# Altium schematic sheet Attenuverter_v1_SCH.SchDoc
size A
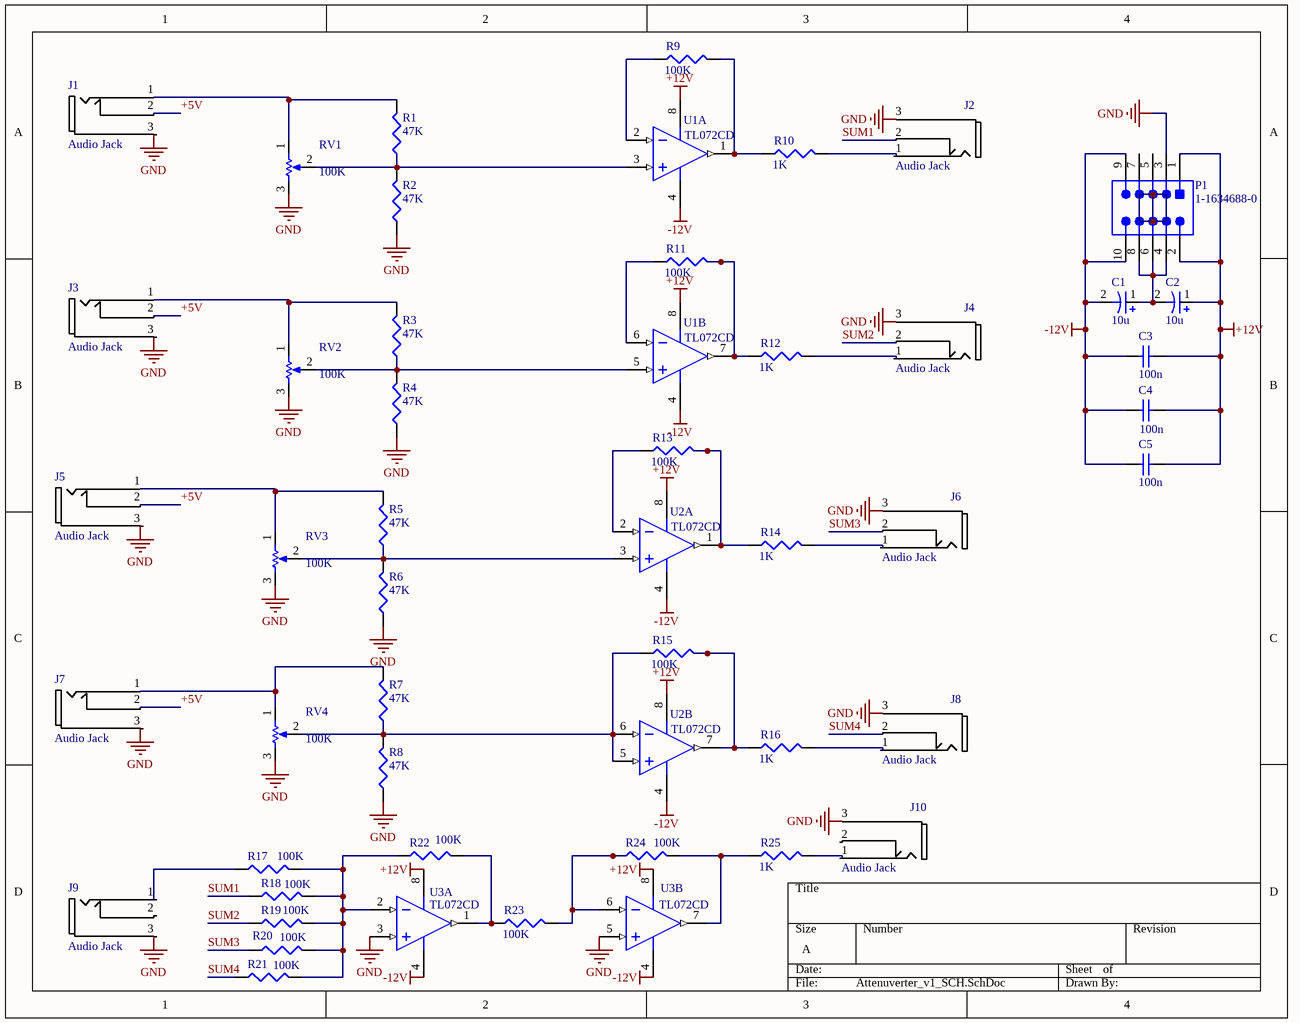
[diagram p0: Attenuverter_v1_SCH.SchDoc]

## Parts
C1  value 10u  [SMD-1210C]  (hidden comment: Cap Pol1)
C2  value 10u  [SMD-1210C]  (hidden comment: Cap Pol1)
C3  value 100n  [0603]  (hidden comment: Cap)
C4  value 100n  [0603]  (hidden comment: Cap)
C5  value 100n  [0603]  (hidden comment: Cap)
J1  Audio Jack  [Audio Jack]
J2  Audio Jack  [Audio Jack]
J3  Audio Jack  [Audio Jack]
J4  Audio Jack  [Audio Jack]
J5  Audio Jack  [Audio Jack]
J6  Audio Jack  [Audio Jack]
J7  Audio Jack  [Audio Jack]
J8  Audio Jack  [Audio Jack]
J9  Audio Jack  [Audio Jack]
J10  Audio Jack  [Audio Jack]
P1  1-1634688-0  [TECO-1-1634688-0-10_V]
R1  value 47K  [J1-0603]  (hidden comment: Res3)
R2  value 47K  [J1-0603]  (hidden comment: Res3)
R3  value 47K  [J1-0603]  (hidden comment: Res3)
R4  value 47K  [J1-0603]  (hidden comment: Res3)
R5  value 47K  [J1-0603]  (hidden comment: Res3)
R6  value 47K  [J1-0603]  (hidden comment: Res3)
R7  value 47K  [J1-0603]  (hidden comment: Res3)
R8  value 47K  [J1-0603]  (hidden comment: Res3)
R9  value 100K  [J1-0603]  (hidden comment: Res3)
R10  value 1K  [J1-0603]  (hidden comment: Res3)
R11  value 100K  [J1-0603]  (hidden comment: Res3)
R12  value 1K  [J1-0603]  (hidden comment: Res3)
R13  value 100K  [J1-0603]  (hidden comment: Res3)
R14  value 1K  [J1-0603]  (hidden comment: Res3)
R15  value 100K  [J1-0603]  (hidden comment: Res3)
R16  value 1K  [J1-0603]  (hidden comment: Res3)
R17  value 100K  [J1-0603]  (hidden comment: Res3)
R18  value 100K  [J1-0603]  (hidden comment: Res3)
R19  value 100K  [J1-0603]  (hidden comment: Res3)
R20  value 100K  [J1-0603]  (hidden comment: Res3)
R21  value 100K  [J1-0603]  (hidden comment: Res3)
R22  value 100K  [J1-0603]  (hidden comment: Res3)
R23  value 100K  [J1-0603]  (hidden comment: Res3)
R24  value 100K  [J1-0603]  (hidden comment: Res3)
R25  value 1K  [J1-0603]  (hidden comment: Res3)
RV1  value 100K  [VR5]  (hidden comment: RPot)
RV2  value 100K  [VR5]  (hidden comment: RPot)
RV3  value 100K  [VR5]  (hidden comment: RPot)
RV4  value 100K  [VR5]  (hidden comment: RPot)
U1  TL072CD  [D0008A_M]  (parts A,B of 2)
U2  TL072CD  [D0008A_M]  (parts A,B of 2)
U3  TL072CD  [D0008A_M]  (parts A,B of 2)

## Nets
+12V: C2.1 C3.1 C4.1 C5.1 P1.1 P1.2 U1.8(VCC+) U2.8(VCC+) U3.8(VCC+)
-12V: C1.2 C3.2 C4.2 C5.2 P1.9 P1.10 U1.4(VCC-) U2.4(VCC-) U3.4(VCC-)
GND: J1.3(G) J2.3(G) J3.3(G) J4.3(G) J5.3(G) J6.3(G) J7.3(G) J8.3(G) J9.3(G) J10.3(G) P1.3 R2.1 R4.1 R6.1 R8.1 RV1.3(TOP) RV2.3(TOP) RV3.3(TOP) RV4.3(TOP) U3.3(IN1+) U3.5(IN2+)
+5V: J1.2(THRU) J3.2(THRU) J5.2(THRU) J7.2(THRU)
SUM1: J2.2(THRU) R18.1
SUM2: J4.2(THRU) R19.1
SUM3: J6.2(THRU) R20.1
SUM4: J8.2(THRU) R21.1
NetC1_1: C1.1 C2.2 P1.4 P1.6 P1.8
NetJ1_1: J1.1(IN) R1.2 RV1.1(BOT)
NetJ2_1: J2.1(IN) R10.2
NetJ3_1: J3.1(IN) R3.2 RV2.1(BOT)
NetJ4_1: J4.1(IN) R12.2
NetJ5_1: J5.1(IN) R5.2 RV3.1(BOT)
NetJ6_1: J6.1(IN) R14.2
NetJ7_1: J7.1(IN) R7.2 RV4.1(BOT)
NetJ8_1: J8.1(IN) R16.2
NetJ9_1: J9.1(IN) R17.1
NetJ10_1: J10.1(IN) R25.2
NetR1_1: R1.1 R2.2 RV1.2(TAP) U1.3(IN1+)
NetR3_1: R3.1 R4.2 RV2.2(TAP) U1.5(IN2+)
NetR5_1: R5.1 R6.2 RV3.2(TAP) U2.3(IN1+)
NetR7_1: R7.1 R8.2 R15.1 RV4.2(TAP) U2.5(IN2+) U2.6(IN2-)
NetR9_1: R9.1 U1.2(IN1-)
NetR9_2: R9.2 R10.1 U1.1(OUT1)
NetR11_1: R11.1 U1.6(IN2-)
NetR11_2: R11.2 R12.1 U1.7(OUT2)
NetR13_1: R13.1 U2.2(IN1-)
NetR13_2: R13.2 R14.1 U2.1(OUT1)
NetR15_2: R15.2 R16.1 U2.7(OUT2)
NetR17_2: R17.2 R18.2 R19.2 R20.2 R21.2 R22.1 U3.2(IN1-)
NetR22_2: R22.2 R23.1 U3.1(OUT1)
NetR23_2: R23.2 R24.1 U3.6(IN2-)
NetR24_2: R24.2 R25.1 U3.7(OUT2)

Not connected (* = marked no-connect by the designer): J9 2(THRU); J10 2(THRU); P1 5 7

## Library data of the parts
C1 C2 = Cap Pol1: Polarized Capacitor (Radial); Published: 8-Jun-2000; LatestRevisionDate: 17-Jul-2002; LatestRevisionNote: Re-released for DXP Platform.; PackageReference: RB7.6-15; Publisher: Altium Limited; PackageDescription: Polarized Capacitor (Radial); 2 Leads
C3-C5 = Cap: Capacitor; Published: 8-Jun-2000; LatestRevisionDate: 17-Jul-2002; LatestRevisionNote: Re-released for DXP Platform.; PackageReference: RAD-0.3; Publisher: Altium Limited; PackageDescription: Radial Cap, Thru-Hole; 2 Leads; 0.3 in Pin Spacing
P1 = CMP-2000-05854-1: Male Header, Pitch 2.54 mm, 2 x 5 Postion, Height 9.15 mm, Tail Length 3.2 mm, -40 to 105 degC, RoHS, Bulk; Manufacturer: TE Connectivity; No. of Rows: 2; SVHC: ToBeAdvised; Package Version: Rev. C2, 02/2011; No. of Contacts: 10Contacts; Pitch: 2.54mm; No. of Positions: 10; Contact Termination Type: ThroughHole; Package Description: 10-Pin Connector, Body 20.35 x 8.7 mm, Pitch 2.54 mm; Orientation: Straight; Gender: Header; Mounting Technology: ThroughHole; Product Range: -; PartNumber: 1-1634688-0; Datasheet Version: Rev. C2, 02/2011; Contact Material: Brass; Package URL: https://datasheet.ciiva.com/6831/eng-cd-1634688-c2-6831201.pdf; Package Reference: 1-1634688-0; Pitch Spacing: 2.54mm; Contact Plating: GoldPlatedContacts; Manufacturer URL: http://www.te.com/; Datasheet URL: https://datasheet.ciiva.com/6831/eng-cd-1634688-c2-6831201.pdf
R1-R25 = Res3: Resistor; Published: 8-Jun-2000; LatestRevisionDate: 29-May-2009; LatestRevisionNote: IPC-7351 Footprint Added.; PackageReference: J1-0603; Publisher: Altium Limited; PackageDescription: Chip Resistor
RV1-RV4 = RPot: Potentiometer; Sim Note: Enter the Resistance value and the set point into parameter fields.; Set Position: 0.5; Published: 8-Jun-2000; LatestRevisionDate: 17-Jul-2002; LatestRevisionNote: Re-released for DXP Platform.; PackageReference: VR5; Publisher: Altium Limited; PackageDescription: Variable Resistor, Thru-Hole; 3 Leads
U1-U3 = CMP-0017-00467-2: Dual Low-Noise JFET-Input General-Purpose Operational Amplifier, 7 to 36 V, 0 to 70 degC, 8-pin SOIC (D8), Green (RoHS & no Sb/Br); Manufacturer: Texas Instruments; Slew Rate(Typ)(V/us): 13; Total Supply Voltage(Max)(+5V is 5, +/-5V is 10): 36; Rating: Catalog; Sub Family: General Purpose Amplifier, High Supply Voltage Amplifier (>=30V); Total Supply Voltage(Min)(+5V is 5, +/-5V is 10): 7; Vn at 1kHz(Typ)(nV/rtHz): 18; IIB(Max)(pA): 200; Vio (25C)(Max)(mV): 10; Number of Channels: 2; Iq per channel(Max)(mA): 2.5; CMRR(Min)(dB): 70; GBW(Typ)(MHz): 3; ComponentLink3Description: Package Specification; DatasheetVersion: SLOS080J; Eco-Plan: Green (RoHS & no Sb/Br); PartNumber: TL072CD; Offset Drift(Typ)(uV/C): 18; ComponentLink2URL: http://www.ti.com/lit/ds/symlink/tl072.pdf; ComponentLink2Description: Datasheet; ComponentLink1URL: http://www.ti.com/; PackageDescription: 8-Pin Plastic Small Outline, Body 4.9 x 3.9 mm, Pitch 1.27 mm; Mounting Technology: Surface Mount; Code_JEDEC: MS-012; PackageVersion: 4040047-3/M, 06/2011; PackageReference: D0008A; ComponentLink3URL: http://www.ti.com/litv/pdf/msoi002j; ComponentLink1Description: Manufacturer URL